# Altium schematic sheet FrontPage.SchDoc
size 381 x 279 mm; Organization: SACO Technologies; Address1: 7806, Trans-Canada Hwy; Address2: Montreal, QC, Canada - H4S1L3.; Address3: H4S1L3; Revision: C; SheetNumber: 1; SheetTotal: 6; ELE682ProjectName: Conditioning & TLL PCB; SchDesignedBy1: Alexis Gagnon; SchDesignedBy2: Megane Cyr; ProjectRevision: C
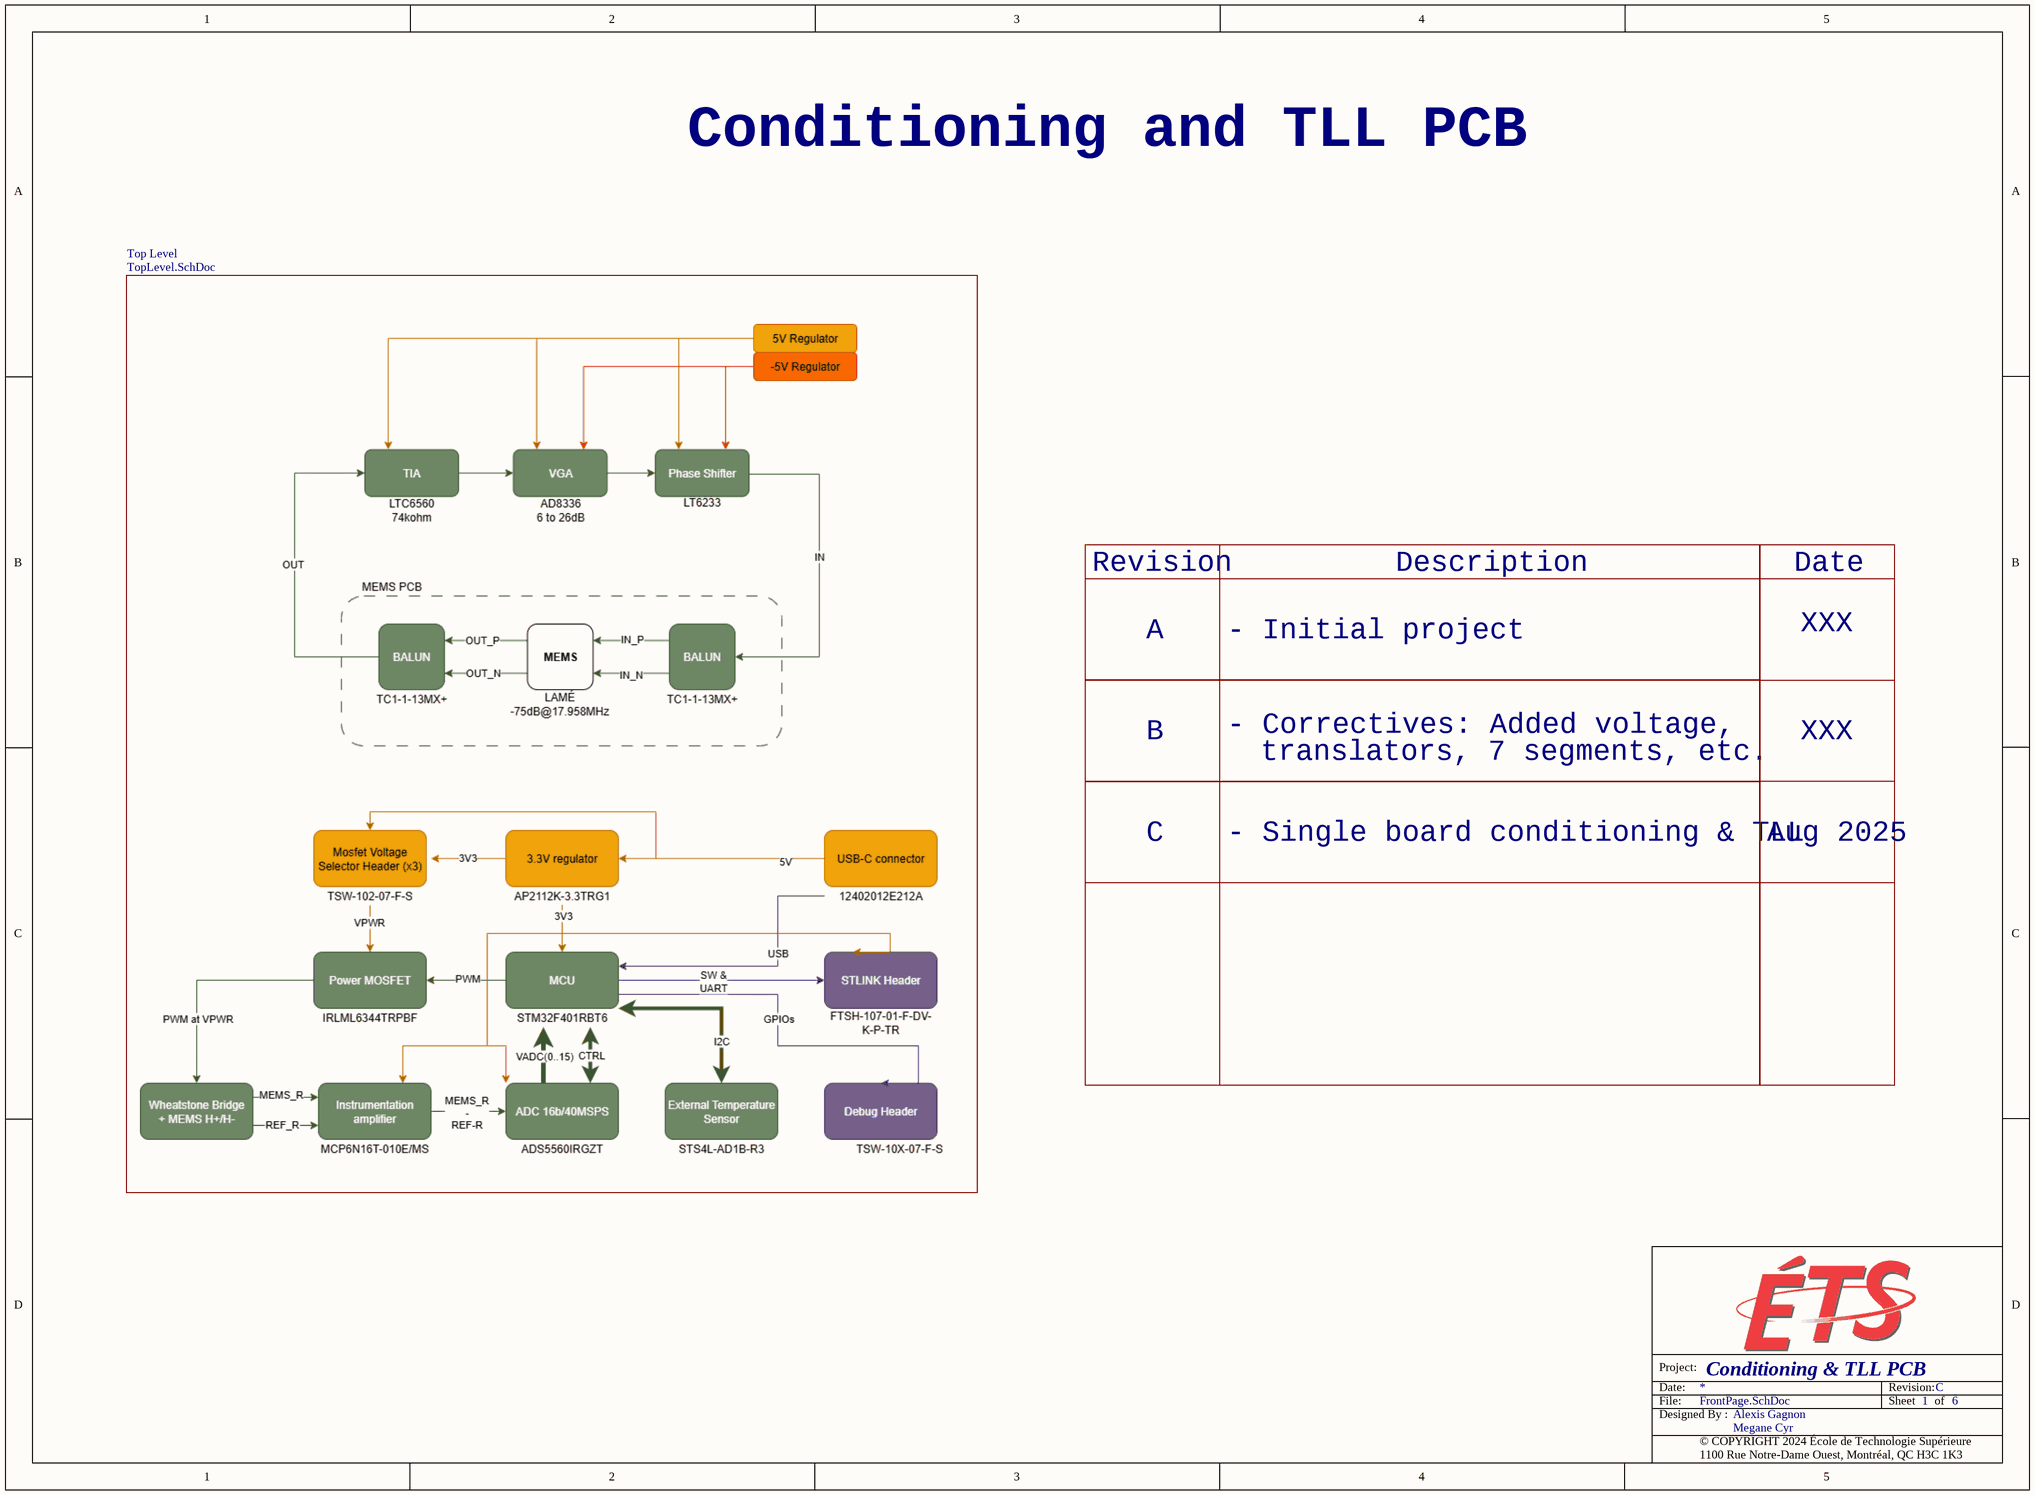
[diagram p0: FrontPage.SchDoc]

## Sub-sheets
Top Level = TopLevel.SchDoc: no entries

## Notes on the sheet
- Conditioning and TLL PCB
- Revision
- Description
- Date
- XXX
- A
- - Initial project
- B
- - Correctives: Added voltage,
- translators, 7 segments, etc.
- C
- - Single board conditioning & TLL
- Aug 2025
- Project:
- File:
- Date:
- Designed By :
- © COPYRIGHT 2024 École de Technologie Supérieure
- Revision:
- Sheet
- of
- 1100 Rue Notre-Dame Ouest, Montréal, QC H3C 1K3